# Altium schematic sheet MCU.SchDoc
size A; SheetNumber: 2; SheetTotal: 10
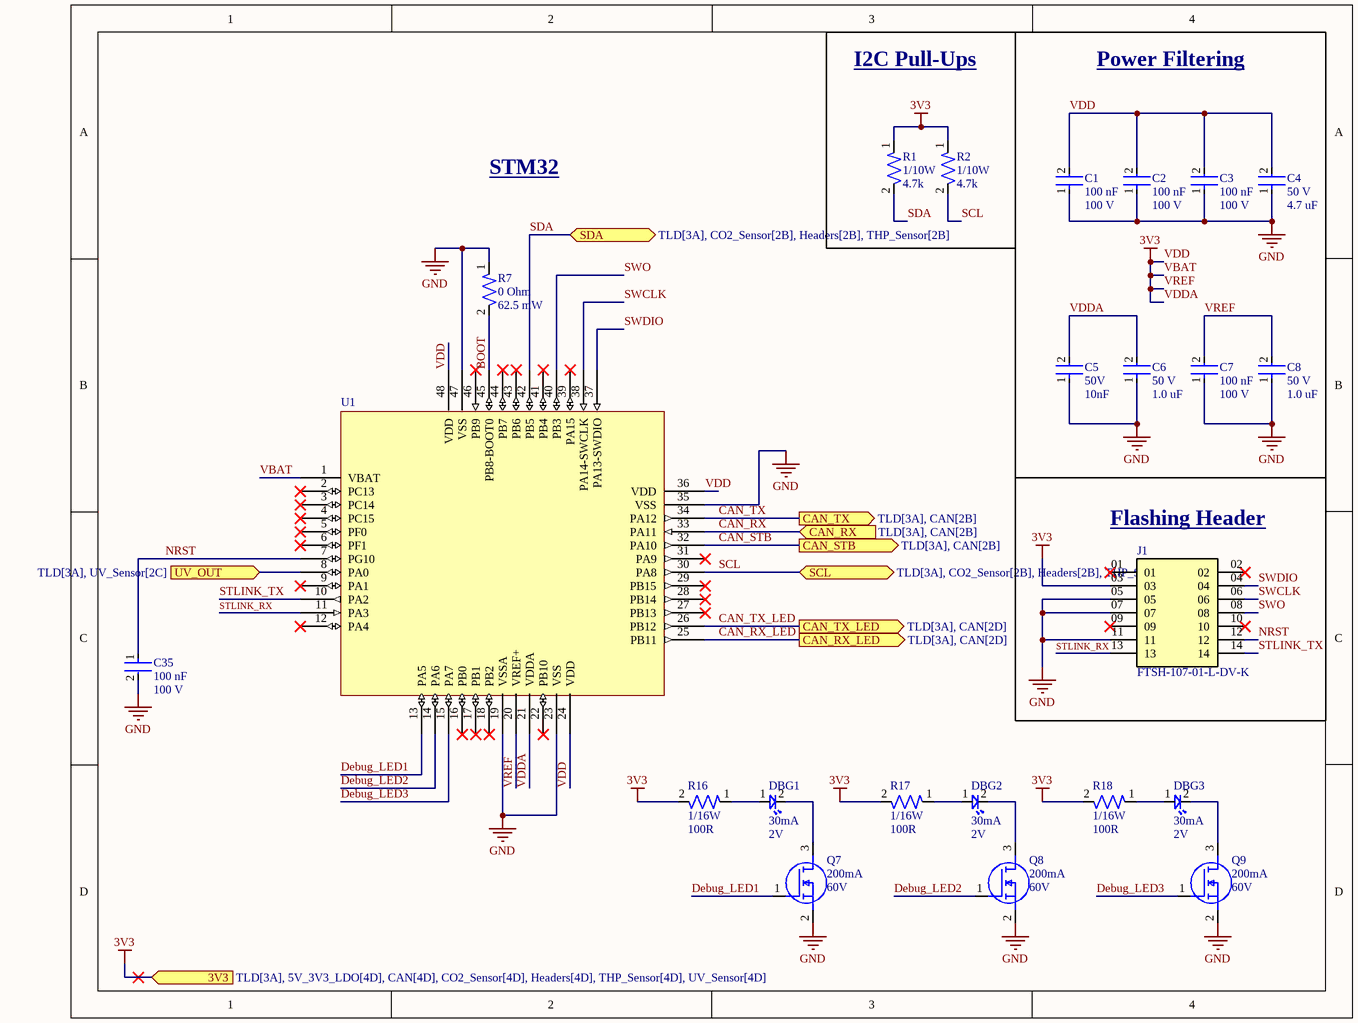
[diagram p0: MCU.SchDoc]

## Parts
C1  Capacitance: 100 nF  Voltage: 100 V  [CAP-0603]  (hidden comment: CC0603KRX7R0BB104)
C2  Capacitance: 100 nF  Voltage: 100 V  [CAP-0603]  (hidden comment: CC0603KRX7R0BB104)
C3  Capacitance: 100 nF  Voltage: 100 V  [CAP-0603]  (hidden comment: CC0603KRX7R0BB104)
C4  Voltage: 50 V  Capacitance: 4.7 uF  [CAP-0805]  (hidden comment: CC0805KKX5R9BB475)
C5  Voltage: 50V  Capacitance: 10nF  [CAP-0805]  (hidden comment: GRM2195C1H103JA01D)
C6  Voltage: 50 V  Capacitance: 1.0 uF  [CAP-0805]  (hidden comment: CC0805KKX7R9BB105)
C7  Capacitance: 100 nF  Voltage: 100 V  [CAP-0603]  (hidden comment: CC0603KRX7R0BB104)
C8  Voltage: 50 V  Capacitance: 1.0 uF  [CAP-0805]  (hidden comment: CC0805KKX7R9BB105)
C35  Capacitance: 100 nF  Voltage: 100 V  [CAP-0603]  (hidden comment: CC0603KRX7R0BB104)
DBG1  Forward Current: 30mA  Forward Voltage: 2V  [LED-0603]  (hidden comment: BL-HKC36G-AV-TRB)
DBG2  Forward Current: 30mA  Forward Voltage: 2V  [LED-0603]  (hidden comment: BL-HKC36G-AV-TRB)
DBG3  Forward Current: 30mA  Forward Voltage: 2V  [LED-0603]  (hidden comment: BL-HKC36G-AV-TRB)
J1  FTSH-107-01-L-DV-K  [SAMTEC_FTSH-107-01-L-DV-K]
Q7  Continuous Current: 200mA  Voltage: 60V  [IC-SOT23-3]  (hidden comment: T2N7002AK,LM)
Q8  Continuous Current: 200mA  Voltage: 60V  [IC-SOT23-3]  (hidden comment: T2N7002AK,LM)
Q9  Continuous Current: 200mA  Voltage: 60V  [IC-SOT23-3]  (hidden comment: T2N7002AK,LM)
R1  Power: 1/10W  Resistance: 4.7k  [RES-0603]  (hidden comment: RC0603FR-074K7L)
R2  Power: 1/10W  Resistance: 4.7k  [RES-0603]  (hidden comment: RC0603FR-074K7L)
R7  Resistance: 0 Ohm  Power: 62.5 mW  [RES-0402]  (hidden comment: RC0402FR-070RL)
R16  Power: 1/16W  Resistance: 100R  [RES-0402]  (hidden comment: RC0402FR-07100RL)
R17  Power: 1/16W  Resistance: 100R  [RES-0402]  (hidden comment: RC0402FR-07100RL)
R18  Power: 1/16W  Resistance: 100R  [RES-0402]  (hidden comment: RC0402FR-07100RL)
U1  STM32G431CBT6  [IC-LQFP48]  (value not drawn)

## Blocks framed on the sheet
I2C Pull-Ups: R1 R2
Power Filtering: C1-C8
Flashing Header: J1

## Ports
3V3 (in, see TLD[3A], 5V_3V3_LDO[4D], CAN[4D], CO2_Sensor[4D], Headers[4D], THP_Sensor[4D], UV_Sensor[4D]), CAN_RX (in, see TLD[3A], CAN[2B]), CAN_RX_LED (out, see TLD[3A], CAN[2D]), CAN_STB (out, see TLD[3A], CAN[2B]), CAN_TX (out, see TLD[3A], CAN[2B]), CAN_TX_LED (out, see TLD[3A], CAN[2D]), SCL (bidir, see TLD[3A], CO2_Sensor[2B], Headers[2B], THP_Sensor[2B]), SDA (bidir, see TLD[3A], CO2_Sensor[2B], Headers[2B], THP_Sensor[2B]), UV_OUT (in, see TLD[3A], UV_Sensor[2C])

## Nets
GND: C1.1 C2.1 C3.1 C4.1 C5.1 C6.1 C7.1 C8.1 C35.2 J1.05 J1.07 J1.11 Q7.2(S) Q8.2(S) Q9.2(S) R7.1 U1.19(VSSA) U1.23(VSS) U1.35(VSS) U1.47(VSS)
VBAT: C1.2 C2.2 C3.2 C4.2 C5.2 C6.2 C7.2 C8.2 J1.03 R1.1 R2.1 R16.2 R17.2 R18.2 U1.1(VBAT) U1.20(VREF+) U1.21(VDDA) U1.24(VDD) U1.36(VDD) U1.48(VDD) ; port 3V3  [also labelled 3V3, VDD, VDDA, VREF]
BOOT: R7.2 U1.45(PB8-BOOT0)
CAN_RX: U1.33(PA11) ; port CAN_RX
CAN_RX_LED: U1.25(PB11) ; port CAN_RX_LED
CAN_STB: U1.32(PA10) ; port CAN_STB
CAN_TX: U1.34(PA12) ; port CAN_TX
CAN_TX_LED: U1.26(PB12) ; port CAN_TX_LED
Debug_LED1: Q7.1(G) U1.13(PA5)
Debug_LED2: Q8.1(G) U1.14(PA6)
Debug_LED3: Q9.1(G) U1.15(PA7)
NRST: C35.1 J1.12 U1.7(PG10)
SCL: R2.2 U1.30(PA8) ; port SCL
SDA: R1.2 U1.42(PB5) ; port SDA
STLINK_RX: J1.13 U1.11(PA3)
STLINK_TX: J1.14 U1.10(PA2)
SWCLK: J1.06 U1.38(PA14-SWCLK)
SWDIO: J1.04 U1.37(PA13-SWDIO)
SWO: J1.08 U1.40(PB3)
UV_OUT: U1.8(PA0) ; port UV_OUT
NetDBG1_1: DBG1.1 R16.1
NetDBG1_2: DBG1.2 Q7.3(D)
NetDBG2_1: DBG2.1 R17.1
NetDBG2_2: DBG2.2 Q8.3(D)
NetDBG3_1: DBG3.1 R18.1
NetDBG3_2: DBG3.2 Q9.3(D)

Not connected (* = marked no-connect by the designer): J1 01* 02* 09* 10*; U1 2(PC13)* 3(PC14)* 4(PC15)* 5(PF0)* 6(PF1)* 9(PA1)* 12(PA4)* 16(PB0)* 17(PB1)* 18(PB2)* 22(PB10)* 27(PB13)* 28(PB14)* 29(PB15)* 31(PA9)* 39(PA15)* 41(PB4)* 43(PB6)* 44(PB7)* 46(PB9)*

## Notes on the sheet
- STM32

## Library data of the parts
C1-C3 C7 C35 = CAP-100N-0001: CAP CER 0.1UF 100V X7R 0603; Device Class: Ceramic; Size: 0603; ComponentLink1Description: Datasheet; ComponentLink1URL: https://www.yageo.com/upload/media/product/app/datasheet/mlcc/upy-np0x7r_mv_100-to-630v.pdf
C4 = CAP-4.7U-0002: CAP CER 4.7UF 50V X5R 0805; ComponentLink2Description: Datasheet; ComponentLink2URL: http://www.yageo.com/documents/recent/UPY-GPHC_Y5V_6.3V-to-50V_8.pdf; Device Class: Ceramic; Size: 0805
C5 = CAP-10N-0001: CAP CER 10000PF 50V C0G/NP0 0805; Device Class: Ceramic; Size: 0805; ComponentLink1Description: Datasheet; ComponentLink1URL: https://search.murata.co.jp/Ceramy/image/img/A01X/G101/ENG/GRM2195C1H103JA01-01.pdf
C6 C8 = CAP-1U-0001: CAP CER 1UF 50V X7R 0805; ComponentLink2URL: https://www.yageo.com/upload/media/product/productsearch/datasheet/mlcc/UPY-GPHC_X7R_6.3V-to-250V_24.pdf; ComponentLink2Description: Datasheet; Device Class: Ceramic; Size: 0805
DBG1-DBG3 = LED-0001: LED YELLOW CLEAR 0603 SMD; ComponentLink1Description: Datasheet; ComponentLink1URL: https://www.americanbrightled.com/pdffiles/led-components/smt/BL-HKC36G-AV-TRB.pdf
J1 = CONN_Flashing-0001: Connector Header Surface Mount 14 position 0.050" (1.27mm); MF: Samtec; Value: *; Price: None; Package: None; Availability: Unavailable; MP: FTSH-107-01-L-DV-K; ComponentLink1Description: Datasheet; ComponentLink1URL: https://mm.digikey.com/Volume0/opasdata/d220001/medias/docus/6209/ftsh-1xx-xx-xxx-dv-xxx-xxx-x-xx-mkt.pdf
Q7-Q9 = NMOS-200MA-0001: MOSFET N-CH 60V 200MA SOT23; ComponentLink1Description: Datasheet; ComponentLink1URL: https://toshiba.semicon-storage.com/info/T2N7002AK_datasheet_en_20150401.pdf?did=29712&prodName=T2N7002AK
R1 R2 = RES-4.7k-0001: RES 4.7K OHM 1% 1/10W 0603; Tolerance: 1%; Size: 0603; ComponentLink1Description: Datasheet; ComponentLink1URL: https://www.yageo.com/upload/media/product/products/datasheet/rchip/PYu-RC_Group_51_RoHS_L_12.pdf
R7 = RES-0-0002-JLC: 62.5mW Thick Film Resistors 50V -55℃~+155℃ 0Ω 0402 Chip Resistor - Surface Mount ROHS; assembled?: yes; JLC part number: C106231
R16-R18 = RES-100-0001: RES 100 OHM 1% 1/16W 0402; Tolerance: 1%; Size: 0402; ComponentLink1Description: Datasheet; ComponentLink1URL: https://www.yageo.com/upload/media/product/products/datasheet/rchip/PYu-RC_Group_51_RoHS_L_12.pdf
U1 = IC-STM32G431CBT6: IC MCU 32BIT 128KB FLASH 48LQFP; Package: 48LQFP; ComponentLink1Description: Datasheet; ComponentLink1URL: https://www.st.com/resource/en/datasheet/stm32g431cb.pdf